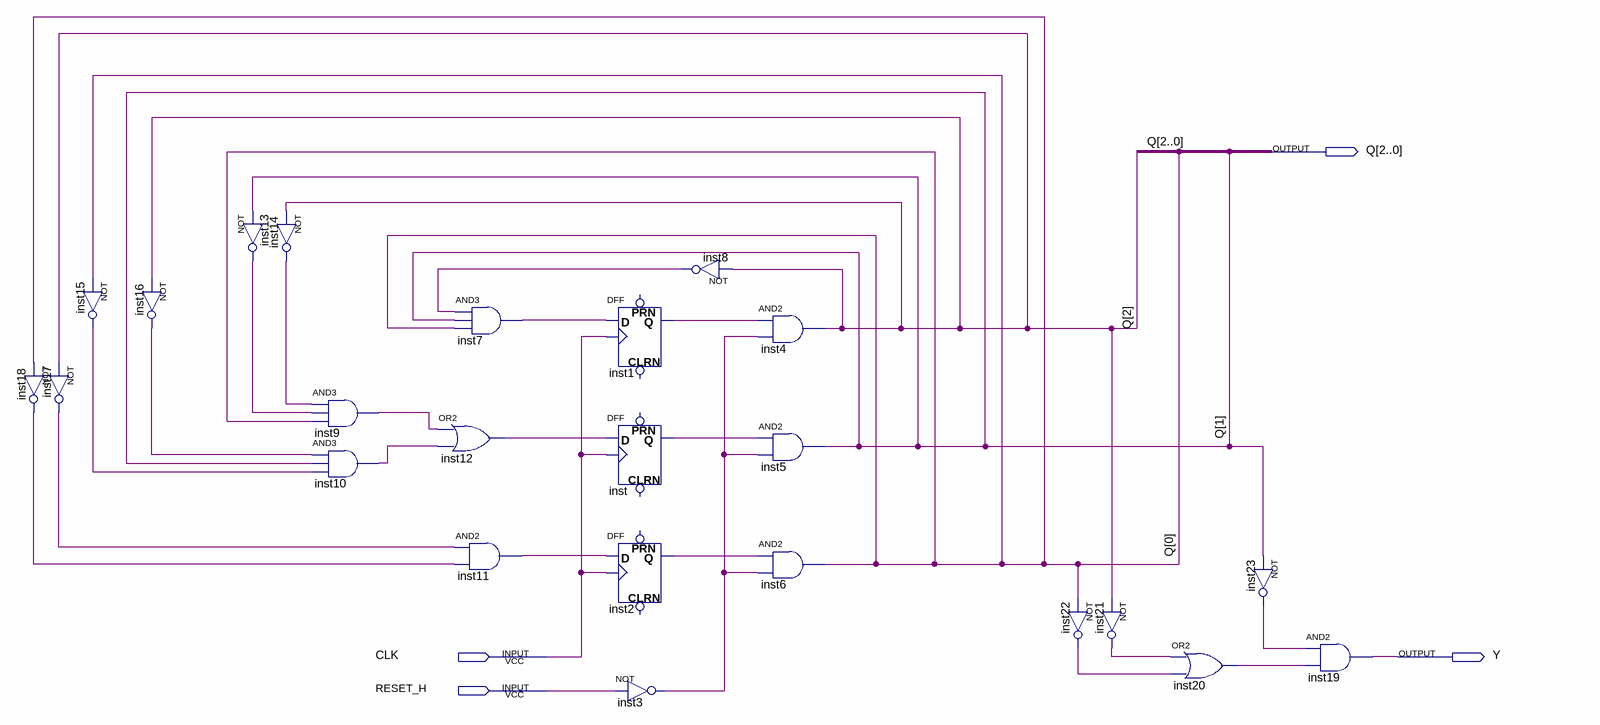
[diagram p0: schematic sheet]
// Quartus schematic enunciado1.bdf as structural Verilog: 24 symbols, 4 pins
module enunciado1 (
  input  CLK,
  input  RESET_H,
  output [2:0] Q,
  output Y
);

  wire inst1_q, inst2_q, inst3_out, inst7_out, inst8_out, inst9_out, inst10_out, inst11_out, inst12_out,
       inst13_out, inst14_out, inst15_out, inst16_out, inst17_out, inst18_out, inst20_out, inst21_out,
       inst22_out, inst23_out, inst_q;

  not inst15 (inst15_out, Q[0]);
  not inst17 (inst17_out, Q[2]);
  not inst18 (inst18_out, Q[0]);
  not inst16 (inst16_out, Q[2]);
  not inst13 (inst13_out, Q[1]);
  not inst14 (inst14_out, Q[2]);
  and inst9 (inst9_out, inst14_out, inst13_out, Q[0]);
  and inst10 (inst10_out, inst16_out, Q[1], inst15_out);
  and inst7 (inst7_out, inst8_out, Q[1], Q[0]);
  or inst12 (inst12_out, inst9_out, inst10_out);
  and inst11 (inst11_out, inst17_out, inst18_out);
  DFF inst1 (.CLK(CLK), .D(inst7_out), .Q(inst1_q));  // open: CLRN, PRN
  DFF inst (.CLK(CLK), .D(inst12_out), .Q(inst_q));  // open: CLRN, PRN
  DFF inst2 (.CLK(CLK), .D(inst11_out), .Q(inst2_q));  // open: CLRN, PRN
  not inst3 (inst3_out, RESET_H);
  not inst8 (inst8_out, Q[2]);
  and inst4 (Q[2], inst1_q, inst3_out);
  and inst5 (Q[1], inst_q, inst3_out);
  and inst6 (Q[0], inst2_q, inst3_out);
  not inst22 (inst22_out, Q[0]);
  not inst21 (inst21_out, Q[2]);
  or inst20 (inst20_out, inst21_out, inst22_out);
  not inst23 (inst23_out, Q[1]);
  and inst19 (Y, inst23_out, inst20_out);
endmodule
